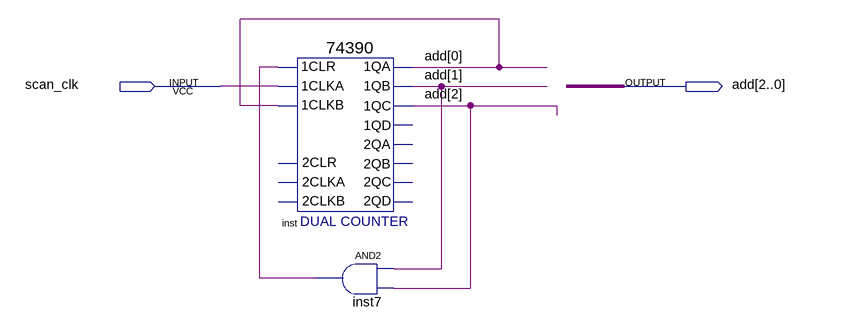
[diagram p0: schematic sheet]
// Quartus schematic m6.bdf as structural Verilog: 2 symbols, 2 pins
module m6 (
  input  scan_clk,
  output [2:0] add
);

  wire inst7_out;

  \74390  inst (
    .\1CLR (inst7_out), .\1CLKA (scan_clk), .\1CLKB (add[0]), .\1QA (add[0]), .\1QB (add[1]), .\1QC (add[2]));  // open: 2CLKA, 2CLR, 2CLKB, 1QD, 2QA, 2QB, 2QC, 2QD
  and inst7 (inst7_out, add[1], add[2]);
endmodule
